# Altium schematic sheet Top_Control_Board_Model_C201.SchDoc: BLDC Motor Driver Block Diagram
size A3; DocumentNumber: 1; SheetNumber: 1; SheetTotal: 50
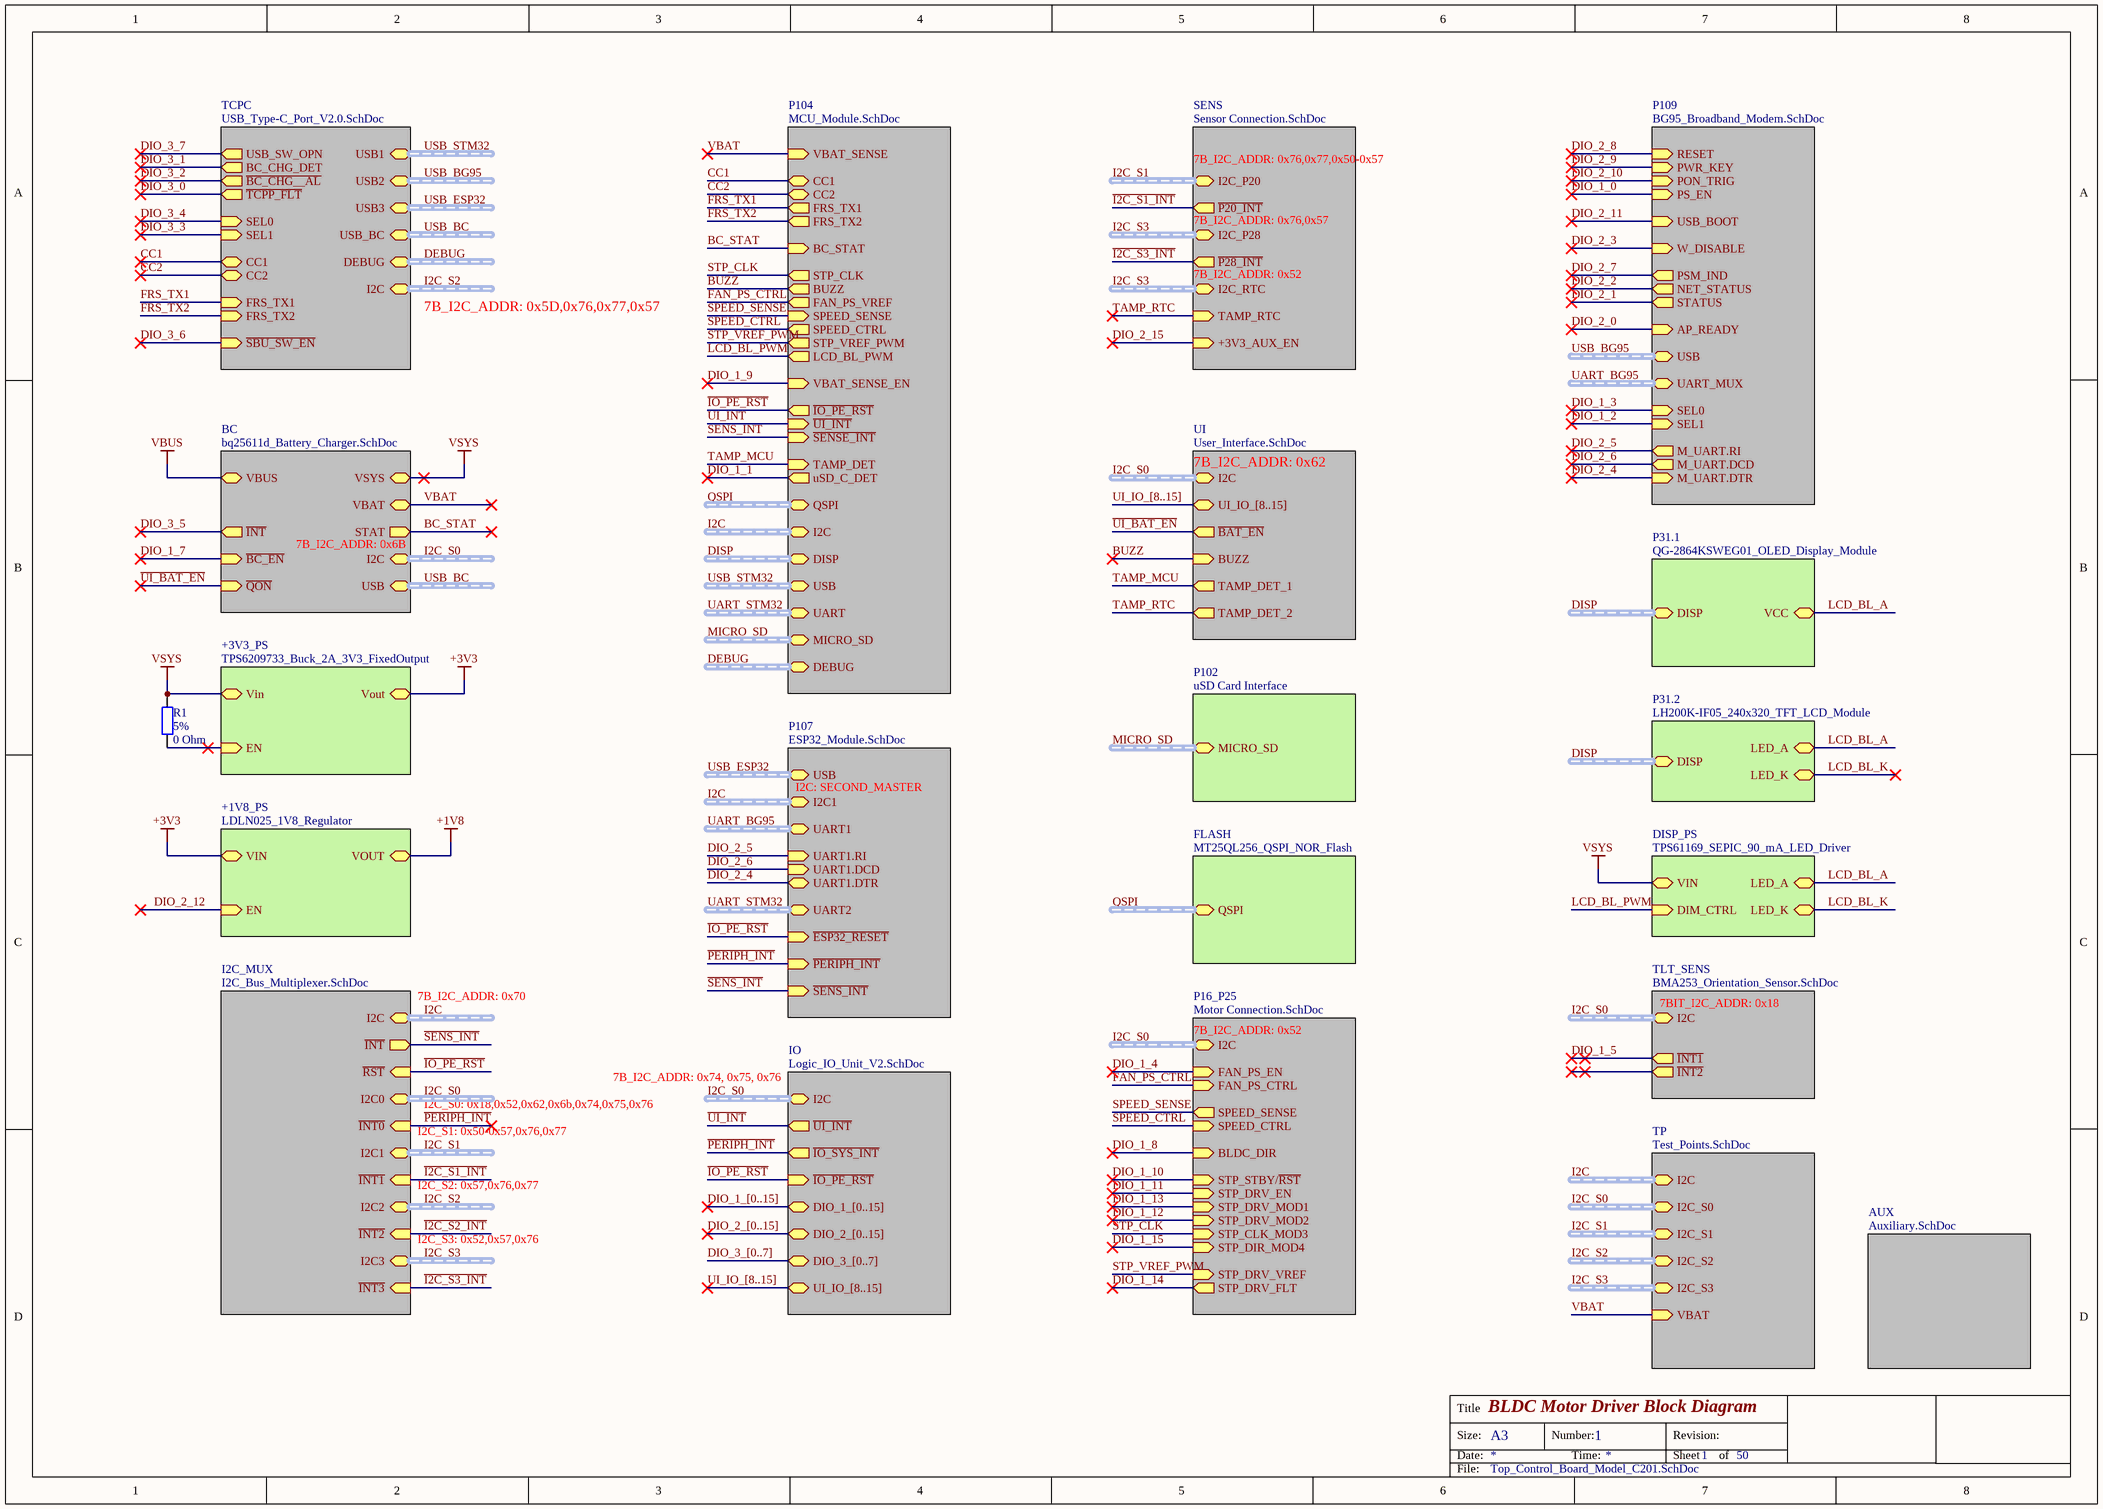
[diagram p0: Top_Control_Board_Model_C201.SchDoc]

## Parts
R1  Tolerance: 5%  Resistance: 0 Ohm  [R0402]  (hidden comment: RES SMD 0 OHM JUMPER 1/16W 0402)

## Sub-sheets
+1V8_PS = LDLN025_1V8_Regulator: EN (in), VIN, VOUT
+3V3_PS = TPS6209733_Buck_2A_3V3_FixedOutput: Vout, Vin, EN (in)
AUX = Auxiliary.SchDoc: no entries
BC = bq25611d_Battery_Charger.SchDoc: VSYS, VBUS, ~{QON} (in), USB (harness USB), I2C (harness I2C), ~{INT} (out), STAT (out), ~{BC_EN} (in), VBAT  | 7B_I2C_ADDR: 0x6B
DISP_PS = TPS61169_SEPIC_90_mA_LED_Driver: VIN, LED_K, DIM_CTRL (in), LED_A
FLASH = MT25QL256_QSPI_NOR_Flash: QSPI (harness QSPI)
I2C_MUX = I2C_Bus_Multiplexer.SchDoc: I2C0 (harness I2C), I2C1 (harness I2C), I2C2 (harness I2C), I2C3 (harness I2C), ~{INT0} (in), ~{INT1} (in), ~{INT2} (in), ~{INT3} (in), I2C (harness I2C), ~{INT} (out), ~{RST} (in)  | 7B_I2C_ADDR: 0x70; I2C_S0: 0x18,0x52,0x62,0x6b,0x74,0x75,0x76; I2C_S1: 0x50-0x57,0x76,0x77; I2C_S2: 0x57,0x76,0x77; I2C_S3: 0x52,0x57,0x76
IO = Logic_IO_Unit_V2.SchDoc: I2C (harness I2C), DIO_1_[0..15] (bidir), ~{IO_PE_RST} (in), DIO_2_[0..15] (bidir), DIO_3_[0..7] (bidir), UI_IO_[8..15] (bidir), ~{IO_SYS_INT} (out), ~{UI_INT} (out)  | 7B_I2C_ADDR: 0x74, 0x75, 0x76
P16_P25 = Motor Connection.SchDoc: SPEED_CTRL (in), SPEED_SENSE (out), FAN_PS_CTRL (in), BLDC_DIR (in), I2C (harness I2C), STP_STBY/~{RST} (in), STP_DRV_EN (in), STP_DRV_MOD1 (in), STP_DRV_MOD2 (in), STP_CLK_MOD3 (in), STP_DIR_MOD4 (in), STP_DRV_VREF (in), STP_DRV_FLT (out), FAN_PS_EN (in)  | 7B_I2C_ADDR: 0x52
P31.1 = QG-2864KSWEG01_OLED_Display_Module: DISP (harness DISP_SPI), VCC
P31.2 = LH200K-IF05_240x320_TFT_LCD_Module: DISP (harness DISP_SPI), LED_K, LED_A
P102 = uSD Card Interface: MICRO_SD (harness MICRO_SD)
P104 = MCU_Module.SchDoc: FAN_PS_VREF (out), SPEED_CTRL (out), SPEED_SENSE (in), CC2 (bidir), CC1 (bidir), I2C (harness I2C), BC_STAT (in), BUZZ (out), VBAT_SENSE (in), MICRO_SD (harness MICRO_SD), DISP (harness DISP_SPI), USB (harness USB), ~{IO_PE_RST} (out), STP_CLK (out), STP_VREF_PWM (out), LCD_BL_PWM (out), QSPI (harness QSPI), UART (harness UART), FRS_TX1 (out), FRS_TX2 (out), ~{UI_INT} (in), TAMP_DET (in), ~{SENSE_INT} (in), DEBUG (harness DEBUG), uSD_C_DET (out), VBAT_SENSE_EN (in)
P107 = ESP32_Module.SchDoc: ~{ESP32_RESET} (in), UART2 (harness UART), USB (harness USB), UART1 (harness UART), I2C1 (harness I2C), UART1.RI (in), UART1.DCD (in), UART1.DTR (bidir), ~{PERIPH_INT} (in), ~{SENS_INT} (in)  | I2C: SECOND_MASTER
P109 = BG95_Broadband_Modem.SchDoc: PWR_KEY (in), PON_TRIG (in), W_DISABLE (in), USB_BOOT (in), NET_STATUS (out), AP_READY (in), STATUS (out), PSM_IND (out), PS_EN (in), RESET (in), USB (harness USB), SEL1 (in), SEL0 (in), UART_MUX (harness UART), M_UART.RI (out), M_UART.DCD (out), M_UART.DTR (in)
SENS = Sensor Connection.SchDoc: ~{P20_INT} (out), I2C_P20 (harness I2C), I2C_P28 (harness I2C), ~{P28_INT} (out), +3V3_AUX_EN (in), I2C_RTC (harness I2C), TAMP_RTC (in)  | 7B_I2C_ADDR: 0x76,0x77,0x50-0x57; 7B_I2C_ADDR: 0x76,0x57; 7B_I2C_ADDR: 0x52
TCPC = USB_Type-C_Port_V2.0.SchDoc: CC1 (bidir), CC2 (bidir), USB1 (harness USB), USB2 (harness USB), SEL1 (in), SEL0 (in), BC_CHG_DET (out), USB_SW_OPN (out), ~{TCPP_FLT} (out), USB3 (harness USB), ~{BC_CHG__AL} (out), USB_BC (harness USB), FRS_TX1 (in), FRS_TX2 (in), I2C (harness I2C), ~{SBU_SW_EN} (in), DEBUG (harness DEBUG)  | 7B_I2C_ADDR: 0x5D,0x76,0x77,0x57
TLT_SENS = BMA253_Orientation_Sensor.SchDoc: ~{INT2} (out), ~{INT1} (out), I2C (harness I2C)  | 7BIT_I2C_ADDR: 0x18
TP = Test_Points.SchDoc: I2C (harness I2C), I2C_S0 (harness I2C), I2C_S1 (harness I2C), I2C_S2 (harness I2C), I2C_S3 (harness I2C), VBAT (in)
UI = User_Interface.SchDoc: ~{BAT_EN} (out), BUZZ (in), TAMP_DET_1 (out), UI_IO_[8..15] (bidir), TAMP_DET_2 (out), I2C (harness I2C)  | 7B_I2C_ADDR: 0x62

## Nets
+1V8: sheet +1V8_PS/VOUT
+3V3: sheet +3V3_PS/Vout, sheet +1V8_PS/VIN
VBUS: sheet BC/VBUS
VSYS: R1.2 ; sheet BC/VSYS, sheet +3V3_PS/Vin, sheet DISP_PS/VIN
~{I2C_S1_INT}: sheet SENS/~{P20_INT}, sheet I2C_MUX/~{INT1}
~{I2C_S2_INT}: sheet I2C_MUX/~{INT2}
~{I2C_S3_INT}: sheet SENS/~{P28_INT}, sheet I2C_MUX/~{INT3}
~{IO_PE_RST}: sheet P104/~{IO_PE_RST}, sheet P107/~{ESP32_RESET}, sheet IO/~{IO_PE_RST}, sheet I2C_MUX/~{RST}
~{PERIPH_INT}: sheet P107/~{PERIPH_INT}, sheet IO/~{IO_SYS_INT}, sheet I2C_MUX/~{INT0}
~{SENS_INT}: sheet P104/~{SENSE_INT}, sheet P107/~{SENS_INT}, sheet I2C_MUX/~{INT}
~{UI_BAT_EN}: sheet BC/~{QON}, sheet UI/~{BAT_EN}
~{UI_INT}: sheet P104/~{UI_INT}, sheet IO/~{UI_INT}
BC_STAT: sheet P104/BC_STAT, sheet BC/STAT
BUZZ: sheet P104/BUZZ, sheet UI/BUZZ
CC1: sheet TCPC/CC1, sheet P104/CC1
CC2: sheet TCPC/CC2, sheet P104/CC2
DIO_1_0: sheet P109/PS_EN
DIO_1_1: sheet P104/uSD_C_DET
DIO_1_2: sheet P109/SEL1
DIO_1_3: sheet P109/SEL0
DIO_1_4: sheet P16_P25/FAN_PS_EN
DIO_1_5: sheet TLT_SENS/~{INT1}
DIO_1_7: sheet BC/~{BC_EN}
DIO_1_8: sheet P16_P25/BLDC_DIR
DIO_1_9: sheet P104/VBAT_SENSE_EN
DIO_1_10: sheet P16_P25/STP_STBY/~{RST}
DIO_1_11: sheet P16_P25/STP_DRV_EN
DIO_1_12: sheet P16_P25/STP_DRV_MOD2
DIO_1_13: sheet P16_P25/STP_DRV_MOD1
DIO_1_14: sheet P16_P25/STP_DRV_FLT
DIO_1_15: sheet P16_P25/STP_DIR_MOD4
DIO_2_0: sheet P109/AP_READY
DIO_2_1: sheet P109/STATUS
DIO_2_2: sheet P109/NET_STATUS
DIO_2_3: sheet P109/W_DISABLE
DIO_2_4: sheet P107/UART1.DTR, sheet P109/M_UART.DTR
DIO_2_5: sheet P107/UART1.RI, sheet P109/M_UART.RI
DIO_2_6: sheet P107/UART1.DCD, sheet P109/M_UART.DCD
DIO_2_7: sheet P109/PSM_IND
DIO_2_8: sheet P109/RESET
DIO_2_9: sheet P109/PWR_KEY
DIO_2_10: sheet P109/PON_TRIG
DIO_2_11: sheet P109/USB_BOOT
DIO_2_12: sheet +1V8_PS/EN
DIO_2_15: sheet SENS/+3V3_AUX_EN
DIO_3_0: sheet TCPC/~{TCPP_FLT}
DIO_3_1: sheet TCPC/BC_CHG_DET
DIO_3_2: sheet TCPC/~{BC_CHG__AL}
DIO_3_3: sheet TCPC/SEL1
DIO_3_4: sheet TCPC/SEL0
DIO_3_5: sheet BC/~{INT}
DIO_3_6: sheet TCPC/~{SBU_SW_EN}
DIO_3_7: sheet TCPC/USB_SW_OPN
FAN_PS_CTRL: sheet P104/FAN_PS_VREF, sheet P16_P25/FAN_PS_CTRL
FRS_TX1: sheet TCPC/FRS_TX1, sheet P104/FRS_TX1
FRS_TX2: sheet TCPC/FRS_TX2, sheet P104/FRS_TX2
LCD_BL_A: sheet P31.1/VCC, sheet DISP_PS/LED_A, sheet P31.2/LED_A
LCD_BL_K: sheet DISP_PS/LED_K, sheet P31.2/LED_K
LCD_BL_PWM: sheet P104/LCD_BL_PWM, sheet DISP_PS/DIM_CTRL
SPEED_CTRL: sheet P104/SPEED_CTRL, sheet P16_P25/SPEED_CTRL
SPEED_SENSE: sheet P104/SPEED_SENSE, sheet P16_P25/SPEED_SENSE
STP_CLK: sheet P104/STP_CLK, sheet P16_P25/STP_CLK_MOD3
STP_VREF_PWM: sheet P104/STP_VREF_PWM, sheet P16_P25/STP_DRV_VREF
TAMP_MCU: sheet P104/TAMP_DET, sheet UI/TAMP_DET_1
TAMP_RTC: sheet SENS/TAMP_RTC, sheet UI/TAMP_DET_2
VBAT: sheet TP/VBAT, sheet P104/VBAT_SENSE, sheet BC/VBAT
NetR1_1: R1.1 ; sheet +3V3_PS/EN

## Buses and harness runs
bus DIO_1_[0..15] = sheet IO/DIO_1_[0..15]
bus DIO_2_[0..15] = sheet IO/DIO_2_[0..15]
bus DIO_3_[0..7] = sheet IO/DIO_3_[0..7]
bus UI_IO_[8..15] = sheet IO/UI_IO_[8..15]
bus UI_IO_[8..15] = sheet UI/UI_IO_[8..15]
harness DEBUG = sheet P104/DEBUG
harness DEBUG = sheet TCPC/DEBUG
harness DISP = sheet P31.1/DISP
harness DISP = sheet P31.2/DISP
harness DISP = sheet P104/DISP
harness I2C = sheet I2C_MUX/I2C
harness I2C = sheet P104/I2C
harness I2C = sheet P107/I2C1
harness I2C = sheet TP/I2C
harness I2C_S0 = sheet BC/I2C
harness I2C_S0 = sheet I2C_MUX/I2C0
harness I2C_S0 = sheet IO/I2C
harness I2C_S0 = sheet P16_P25/I2C
harness I2C_S0 = sheet TLT_SENS/I2C
harness I2C_S0 = sheet TP/I2C_S0
harness I2C_S0 = sheet UI/I2C
harness I2C_S1 = sheet I2C_MUX/I2C1
harness I2C_S1 = sheet SENS/I2C_P20
harness I2C_S1 = sheet TP/I2C_S1
harness I2C_S2 = sheet I2C_MUX/I2C2
harness I2C_S2 = sheet TCPC/I2C
harness I2C_S2 = sheet TP/I2C_S2
harness I2C_S3 = sheet I2C_MUX/I2C3
harness I2C_S3 = sheet SENS/I2C_P28
harness I2C_S3 = sheet SENS/I2C_RTC
harness I2C_S3 = sheet TP/I2C_S3
harness MICRO_SD = sheet P102/MICRO_SD
harness MICRO_SD = sheet P104/MICRO_SD
harness QSPI = sheet FLASH/QSPI
harness QSPI = sheet P104/QSPI
harness UART_BG95 = sheet P107/UART1
harness UART_BG95 = sheet P109/UART_MUX
harness UART_STM32 = sheet P104/UART
harness UART_STM32 = sheet P107/UART2
harness USB_BC = sheet BC/USB
harness USB_BC = sheet TCPC/USB_BC
harness USB_BG95 = sheet P109/USB
harness USB_BG95 = sheet TCPC/USB2
harness USB_ESP32 = sheet P107/USB
harness USB_ESP32 = sheet TCPC/USB3
harness USB_STM32 = sheet P104/USB
harness USB_STM32 = sheet TCPC/USB1

## Notes on the sheet
- Title
- Size:
- Date:
- A3
- Number:
- Time:
- Revision:
- Sheet
- of
- File:

## Library data of the parts
R1 = RES SMD 0 OHM JUMPER 1/16W 0402: 0 Ohms Jumper 0.063W, 1/16W Chip Resistor 0402 (1005 Metric) Moisture Resistant Thick Film; Manufacturer: Yageo; Manufacturer Part Number: RC0402JR-070RL; Power Rating: 62.5mW; Voltage Rating: 50V; Max Power Dissipation: 63mW; Temperature Coefficient: 200ppm/°C; Supplier 1: Digi-Key; Stock 1: 46057148; Pricing 1: 1=0.1, 10=0.013, 25=0.0092, 50=0.0072, 100=0.0053, 250=0.004, 500=0.0032, 1000=0.0024, 5000=0.0017 (USD); Contact Plating: Tin,Matte; Case Code (Metric): 1005; Case Code (Imperial): 0402; Min Operating Temperature: -55°C; Max Operating Temperature: 155°C; Packaging: Tape and Reel; Composition: Thick Film; Package Quantity: 1; Number of Terminations: 2; Termination: SMD/SMT; Military Standard: Not; Features: Moisture Resistant; Length: 1mm; Height: 0.016inch; Width: 0.02inch; Depth: 0.5mm; Radiation Hardening: No; REACH SVHC: Unknown; Lead Free: Lead Free; ComponentLink1URL: http://www.yageo.com/documents/recent/PYu-RC_Group_51_RoHS_L_10.pdf?src-supplier=Digi-Key; ComponentLink1Description: http://www.yageo.com/documents/recent/PYu-RC_Group_51_RoHS_L_10.pdf?src-supplier=Digi-Key; ComponentLink2URL: http://www.yageo.com/documents/recent/PYu-RC0402_51_RoHS_L_6.pdf?src-supplier=Avnet+Europe; ComponentLink2Description: http://www.yageo.com/documents/recent/PYu-RC0402_51_RoHS_L_6.pdf?src-supplier=Avnet+Europe; ComponentLink3URL: http://www.farnell.com/datasheets/1018594.pdf?src-supplier=Element14; ComponentLink3Description: http://www.farnell.com/datasheets/1018594.pdf?src-supplier=Element14; ComponentLink4URL: https://www.verical.com/server-webapp/html/getDatasheet?partID=326379&src-supplier=Verical; ComponentLink4Description: https://www.verical.com/server-webapp/html/getDatasheet?partID=326379&src-supplier=Verical; ComponentLink5URL: http://www.farnell.com/datasheets/2167052.pdf?src-supplier=Element14; ComponentLink5Description: http://www.farnell.com/datasheets/2167052.pdf?src-supplier=Element14; Supplier Part Number 1: 311-0.0JRCT-ND; Case/Package: 0402; ClassName: +3V3_PS; Mount: Surface Mount